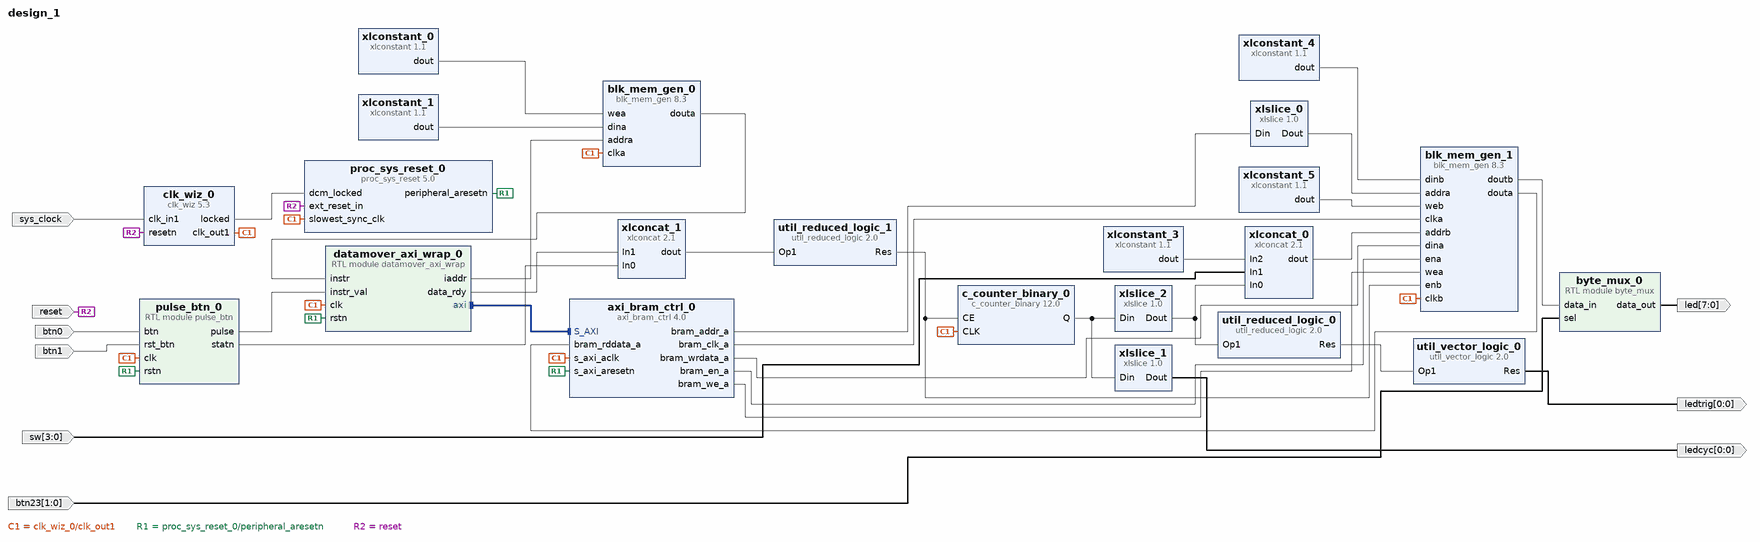
[diagram p0: block diagram of the top level]
# Vivado block design design_1, xc7a35ticsg324-1L, Vivado 2016.4
create_bd_design design_1

create_bd_port -dir I -type clk sys_clock
set_property -dict {CONFIG.FREQ_HZ 100000000 CONFIG.PHASE 0.000} [get_bd_ports sys_clock]
create_bd_port -dir I -type rst reset
set_property -dict {CONFIG.POLARITY ACTIVE_LOW} [get_bd_ports reset]
create_bd_port -dir I -type data btn0
create_bd_port -dir I -type data btn1
create_bd_port -dir I -from 3 -to 0 -type data sw
create_bd_port -dir O -from 7 -to 0 -type data led
create_bd_port -dir I -from 1 -to 0 -type data btn23
create_bd_port -dir O -from 0 -to 0 -type data ledcyc
create_bd_port -dir O -from 0 -to 0 -type data ledtrig

create_bd_cell -type ip -vlnv xilinx.com:ip:blk_mem_gen:8.3 blk_mem_gen_0
set_property -dict [list \
  CONFIG.Enable_32bit_Address false \
  CONFIG.Use_Byte_Write_Enable false \
  CONFIG.Write_Width_A 20 \
  CONFIG.Read_Width_A 20 \
  CONFIG.Enable_A Always_Enabled \
  CONFIG.Register_PortA_Output_of_Memory_Primitives false \
  CONFIG.Load_Init_File true \
  CONFIG.Coe_File datamover_axi.coe \
  CONFIG.Fill_Remaining_Memory_Locations true \
  CONFIG.Remaining_Memory_Locations 0 \
  CONFIG.Use_RSTA_Pin false \
  CONFIG.use_bram_block Stand_Alone \
] [get_bd_cells blk_mem_gen_0]
create_bd_cell -type ip -vlnv xilinx.com:ip:xlconstant:1.1 xlconstant_0
set_property -dict {CONFIG.CONST_VAL 0} [get_bd_cells xlconstant_0]
create_bd_cell -type ip -vlnv xilinx.com:ip:xlconstant:1.1 xlconstant_1
set_property -dict {CONFIG.CONST_WIDTH 20 CONFIG.CONST_VAL 0} [get_bd_cells xlconstant_1]
create_bd_cell -type ip -vlnv xilinx.com:ip:axi_bram_ctrl:4.0 axi_bram_ctrl_0
set_property -dict {CONFIG.PROTOCOL AXI4LITE CONFIG.SINGLE_PORT_BRAM 1} [get_bd_cells axi_bram_ctrl_0]
create_bd_cell -type ip -vlnv xilinx.com:ip:blk_mem_gen:8.3 blk_mem_gen_1
set_property -dict [list \
  CONFIG.Memory_Type True_Dual_Port_RAM \
  CONFIG.Enable_32bit_Address false \
  CONFIG.Use_Byte_Write_Enable true \
  CONFIG.Byte_Size 8 \
  CONFIG.Write_Width_A 32 \
  CONFIG.Read_Width_A 32 \
  CONFIG.Operating_Mode_A WRITE_FIRST \
  CONFIG.Write_Width_B 32 \
  CONFIG.Read_Width_B 32 \
  CONFIG.Enable_B Use_ENB_Pin \
  CONFIG.Register_PortA_Output_of_Memory_Primitives false \
  CONFIG.Register_PortB_Output_of_Memory_Primitives false \
  CONFIG.Load_Init_File true \
  CONFIG.Coe_File datamover_data.coe \
  CONFIG.Use_RSTA_Pin false \
  CONFIG.Port_B_Clock 100 \
  CONFIG.Port_B_Write_Rate 50 \
  CONFIG.Port_B_Enable_Rate 100 \
  CONFIG.use_bram_block Stand_Alone \
] [get_bd_cells blk_mem_gen_1]
create_bd_cell -type ip -vlnv xilinx.com:ip:xlslice:1.0 xlslice_0
set_property -dict {CONFIG.DOUT_WIDTH 10 CONFIG.DIN_TO 2 CONFIG.DIN_FROM 11 CONFIG.DIN_WIDTH 12} [get_bd_cells xlslice_0]
create_bd_cell -type ip -vlnv xilinx.com:ip:c_counter_binary:12.0 c_counter_binary_0
set_property -dict {CONFIG.Output_Width 26 CONFIG.CE true} [get_bd_cells c_counter_binary_0]
create_bd_cell -type ip -vlnv xilinx.com:ip:util_reduced_logic:2.0 util_reduced_logic_0
set_property -dict {CONFIG.C_SIZE 4 CONFIG.C_OPERATION or} [get_bd_cells util_reduced_logic_0]
create_bd_cell -type ip -vlnv xilinx.com:ip:xlconstant:1.1 xlconstant_3
set_property -dict {CONFIG.CONST_WIDTH 2 CONFIG.CONST_VAL 0} [get_bd_cells xlconstant_3]
create_bd_cell -type ip -vlnv xilinx.com:ip:xlconcat:2.1 xlconcat_0
set_property -dict {CONFIG.NUM_PORTS 3 CONFIG.IN0_WIDTH 4 CONFIG.IN1_WIDTH 4 CONFIG.IN2_WIDTH 2} [get_bd_cells xlconcat_0]
create_bd_cell -type ip -vlnv xilinx.com:ip:xlconstant:1.1 xlconstant_4
set_property -dict {CONFIG.CONST_WIDTH 32 CONFIG.CONST_VAL 0} [get_bd_cells xlconstant_4]
create_bd_cell -type ip -vlnv xilinx.com:ip:xlconstant:1.1 xlconstant_5
set_property -dict {CONFIG.CONST_WIDTH 4 CONFIG.CONST_VAL 0} [get_bd_cells xlconstant_5]
create_bd_cell -type ip -vlnv xilinx.com:ip:clk_wiz:5.3 clk_wiz_0
set_property -dict [list \
  CONFIG.CLKOUT1_REQUESTED_OUT_FREQ 10.000 \
  CONFIG.RESET_PORT resetn \
  CONFIG.MMCM_DIVCLK_DIVIDE 2 \
  CONFIG.MMCM_CLKFBOUT_MULT_F 15.625 \
  CONFIG.MMCM_CLKOUT0_DIVIDE_F 78.125 \
  CONFIG.RESET_TYPE ACTIVE_LOW \
  CONFIG.USE_BOARD_FLOW true \
  CONFIG.CLK_IN1_BOARD_INTERFACE sys_clock \
  CONFIG.RESET_BOARD_INTERFACE reset \
  CONFIG.CLKOUT1_JITTER 290.478 \
  CONFIG.CLKOUT1_PHASE_ERROR 133.882 \
] [get_bd_cells clk_wiz_0]
create_bd_cell -type ip -vlnv xilinx.com:ip:xlslice:1.0 xlslice_2
set_property -dict {CONFIG.DOUT_WIDTH 4 CONFIG.DIN_TO 22 CONFIG.DIN_FROM 25 CONFIG.DIN_WIDTH 26} [get_bd_cells xlslice_2]
create_bd_cell -type ip -vlnv xilinx.com:ip:proc_sys_reset:5.0 proc_sys_reset_0
create_bd_cell -type ip -vlnv xilinx.com:ip:util_vector_logic:2.0 util_vector_logic_0
set_property -dict {CONFIG.C_SIZE 1 CONFIG.C_OPERATION not} [get_bd_cells util_vector_logic_0]
create_bd_cell -type module -reference pulse_btn pulse_btn_0
create_bd_cell -type ip -vlnv xilinx.com:ip:util_reduced_logic:2.0 util_reduced_logic_1
set_property -dict {CONFIG.C_SIZE 2 CONFIG.C_OPERATION or} [get_bd_cells util_reduced_logic_1]
create_bd_cell -type ip -vlnv xilinx.com:ip:xlconcat:2.1 xlconcat_1
create_bd_cell -type module -reference byte_mux byte_mux_0
create_bd_cell -type ip -vlnv xilinx.com:ip:xlslice:1.0 xlslice_1
set_property -dict {CONFIG.DOUT_WIDTH 1 CONFIG.DIN_TO 21 CONFIG.DIN_FROM 21 CONFIG.DIN_WIDTH 26} [get_bd_cells xlslice_1]
create_bd_cell -type module -reference datamover_axi_wrap datamover_axi_wrap_0

# ---- connections ----

connect_bd_intf_net [get_bd_intf_pins axi_bram_ctrl_0/S_AXI] [get_bd_intf_pins datamover_axi_wrap_0/axi]
connect_bd_net [get_bd_pins datamover_axi_wrap_0/iaddr] [get_bd_pins blk_mem_gen_0/addra]
connect_bd_net [get_bd_pins blk_mem_gen_0/douta] [get_bd_pins datamover_axi_wrap_0/instr]
connect_bd_net [get_bd_pins clk_wiz_0/clk_out1] \
  [get_bd_pins blk_mem_gen_0/clka] [get_bd_pins axi_bram_ctrl_0/s_axi_aclk] [get_bd_pins c_counter_binary_0/CLK] \
  [get_bd_pins blk_mem_gen_1/clkb] [get_bd_pins proc_sys_reset_0/slowest_sync_clk] [get_bd_pins pulse_btn_0/clk] \
  [get_bd_pins datamover_axi_wrap_0/clk]
connect_bd_net -net clk_wiz_0_locked [get_bd_pins proc_sys_reset_0/peripheral_aresetn] \
  [get_bd_pins axi_bram_ctrl_0/s_axi_aresetn] [get_bd_pins pulse_btn_0/rstn] [get_bd_pins datamover_axi_wrap_0/rstn]
connect_bd_net [get_bd_pins xlconstant_0/dout] [get_bd_pins blk_mem_gen_0/wea]
connect_bd_net [get_bd_pins xlconstant_1/dout] [get_bd_pins blk_mem_gen_0/dina]
connect_bd_net [get_bd_pins axi_bram_ctrl_0/bram_clk_a] [get_bd_pins blk_mem_gen_1/clka]
connect_bd_net [get_bd_pins axi_bram_ctrl_0/bram_wrdata_a] [get_bd_pins blk_mem_gen_1/dina]
connect_bd_net [get_bd_pins axi_bram_ctrl_0/bram_en_a] [get_bd_pins blk_mem_gen_1/ena]
connect_bd_net [get_bd_pins axi_bram_ctrl_0/bram_we_a] [get_bd_pins blk_mem_gen_1/wea]
connect_bd_net [get_bd_pins xlslice_0/Dout] [get_bd_pins blk_mem_gen_1/addra]
connect_bd_net [get_bd_pins axi_bram_ctrl_0/bram_addr_a] [get_bd_pins xlslice_0/Din]
connect_bd_net -net c_counter_binary_0_Q [get_bd_pins xlslice_2/Dout] [get_bd_pins xlconcat_0/In0] [get_bd_pins util_reduced_logic_0/Op1]
connect_bd_net [get_bd_pins xlconcat_0/dout] [get_bd_pins blk_mem_gen_1/addrb]
connect_bd_net [get_bd_pins datamover_axi_wrap_0/data_rdy] [get_bd_pins xlconcat_1/In1]
connect_bd_net [get_bd_pins blk_mem_gen_1/douta] [get_bd_pins axi_bram_ctrl_0/bram_rddata_a]
connect_bd_net [get_bd_pins xlconstant_4/dout] [get_bd_pins blk_mem_gen_1/dinb]
connect_bd_net [get_bd_pins xlconstant_5/dout] [get_bd_pins blk_mem_gen_1/web]
connect_bd_net [get_bd_ports sys_clock] [get_bd_pins clk_wiz_0/clk_in1]
connect_bd_net [get_bd_ports reset] [get_bd_pins clk_wiz_0/resetn] [get_bd_pins proc_sys_reset_0/ext_reset_in]
connect_bd_net [get_bd_pins c_counter_binary_0/Q] [get_bd_pins xlslice_2/Din] [get_bd_pins xlslice_1/Din]
connect_bd_net [get_bd_pins clk_wiz_0/locked] [get_bd_pins proc_sys_reset_0/dcm_locked]
connect_bd_net -net btn0_1 [get_bd_ports btn0] [get_bd_pins pulse_btn_0/btn]
connect_bd_net -net btn1_1 [get_bd_ports btn1] [get_bd_pins pulse_btn_0/rst_btn]
connect_bd_net [get_bd_pins pulse_btn_0/pulse] [get_bd_pins datamover_axi_wrap_0/instr_val]
connect_bd_net [get_bd_pins util_reduced_logic_0/Res] [get_bd_pins util_vector_logic_0/Op1]
connect_bd_net [get_bd_pins xlconstant_3/dout] [get_bd_pins xlconcat_0/In2]
connect_bd_net [get_bd_ports sw] [get_bd_pins xlconcat_0/In1]
connect_bd_net [get_bd_pins pulse_btn_0/statn] [get_bd_pins xlconcat_1/In0]
connect_bd_net [get_bd_pins xlconcat_1/dout] [get_bd_pins util_reduced_logic_1/Op1]
connect_bd_net [get_bd_pins util_reduced_logic_1/Res] [get_bd_pins c_counter_binary_0/CE] [get_bd_pins blk_mem_gen_1/enb]
connect_bd_net [get_bd_pins blk_mem_gen_1/doutb] [get_bd_pins byte_mux_0/data_in]
connect_bd_net [get_bd_pins byte_mux_0/data_out] [get_bd_ports led]
connect_bd_net -net btn23_1 [get_bd_ports btn23] [get_bd_pins byte_mux_0/sel]
connect_bd_net [get_bd_pins xlslice_1/Dout] [get_bd_ports ledcyc]
connect_bd_net [get_bd_pins util_vector_logic_0/Res] [get_bd_ports ledtrig]

# ---- address map ----
assign_bd_address -offset 0x00000000 -range 4K -target_address_space [get_bd_addr_spaces datamover_axi_wrap_0/axi] [get_bd_addr_segs axi_bram_ctrl_0/S_AXI/Mem0]

validate_bd_design
save_bd_design
